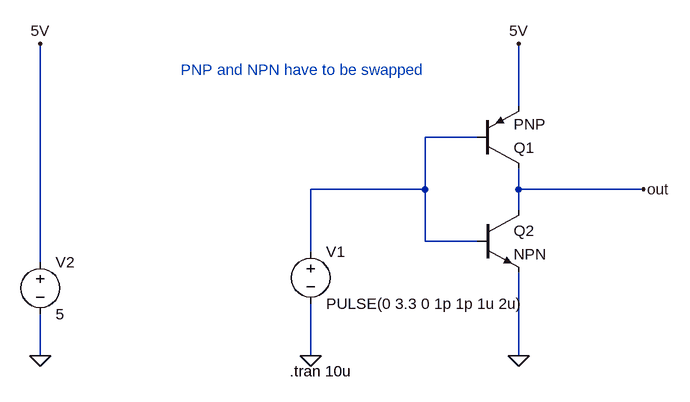
[diagram p0: schematic PushPull.asc]
PushPull.asc, the LTspice schematic file:
Version 4
SHEET 1 880 680
WIRE 224 64 224 -32
WIRE 160 112 80 112
WIRE 80 192 80 112
WIRE 80 192 -96 192
WIRE 224 192 224 160
WIRE 416 192 224 192
WIRE 224 224 224 192
WIRE 80 272 80 192
WIRE 160 272 80 272
WIRE -96 288 -96 192
WIRE -512 304 -512 -32
WIRE -512 448 -512 384
WIRE -96 448 -96 368
WIRE 224 448 224 320
FLAG 416 192 out
FLAG 224 448 0
FLAG -96 448 0
FLAG -512 448 0
FLAG 224 -32 5V
FLAG -512 -32 5V
DATAFLAG -512 416 ""
SYMBOL pnp 160 160 M180
SYMATTR InstName Q1
SYMBOL npn 160 224 R0
SYMATTR InstName Q2
SYMBOL voltage -96 272 R0
WINDOW 123 0 0 Left 0
WINDOW 39 0 0 Left 0
SYMATTR InstName V1
SYMATTR Value PULSE(0 3.3 0 1p 1p 1u 2u)
SYMBOL voltage -512 288 R0
WINDOW 123 0 0 Left 0
WINDOW 39 0 0 Left 0
SYMATTR InstName V2
SYMATTR Value 5
TEXT -128 472 Left 2 !.tran 10u
TEXT -296 8 Left 2 ;PNP and NPN have to be swapped

The netlist it stands for:
* PushPull.asc
Q1 out N001 5V 0 PNP
Q2 out N001 0 0 NPN
V1 N001 0 PULSE(0 3.3 0 1p 1p 1u 2u)
V2 5V 0 5
.model NPN NPN
.model PNP PNP
.lib standard.bjt
.tran 10u
* PNP and NPN have to be swapped
.backanno
.end